# Altium schematic sheet CAMERA.SchDoc
size A2; SheetNumber: 20; SheetTotal: 22
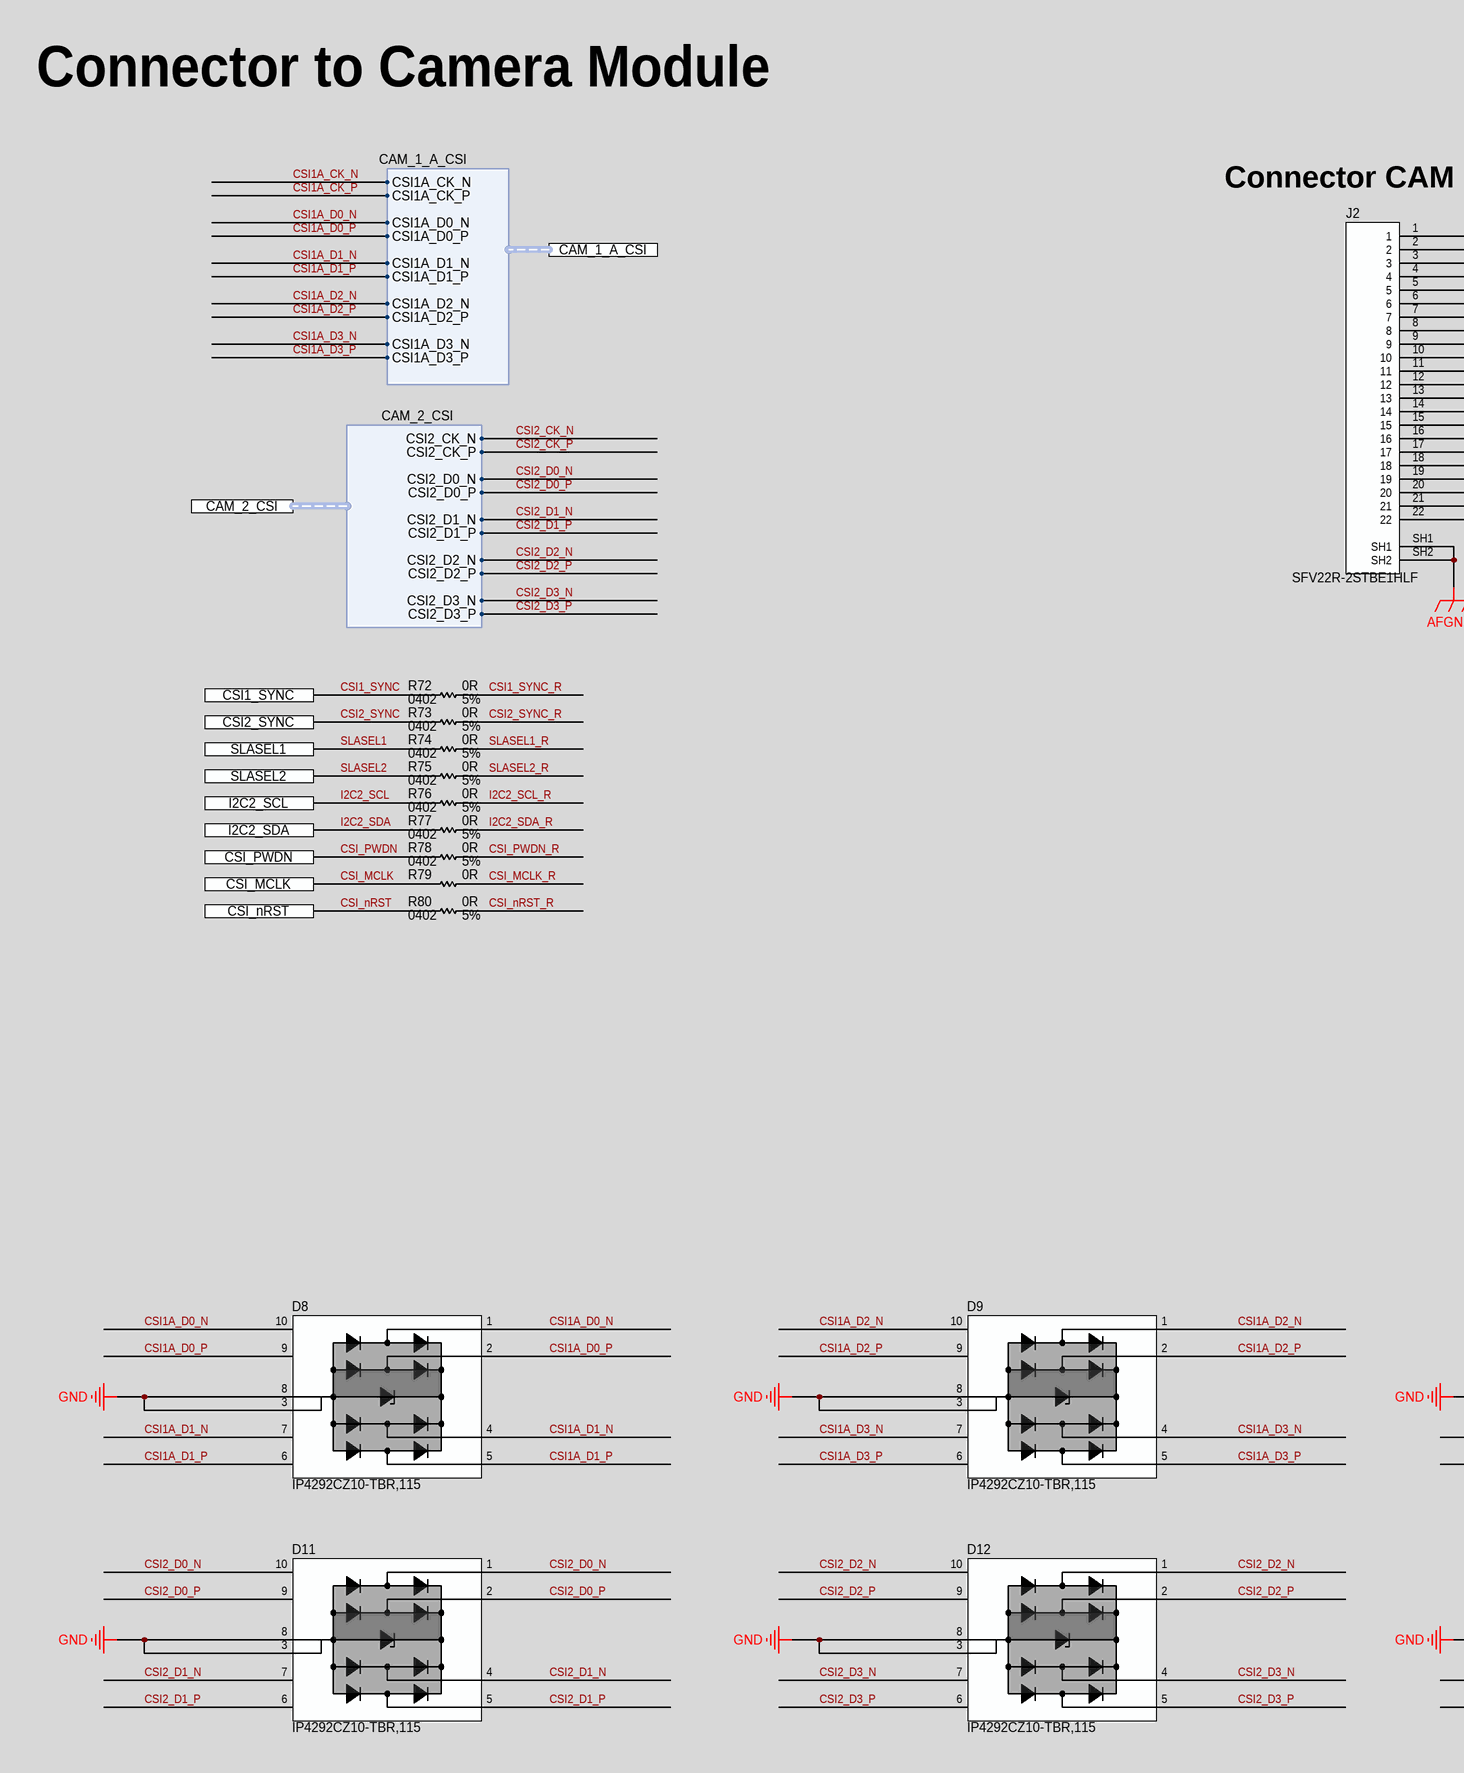
[diagram p0: CAMERA.SchDoc, left]
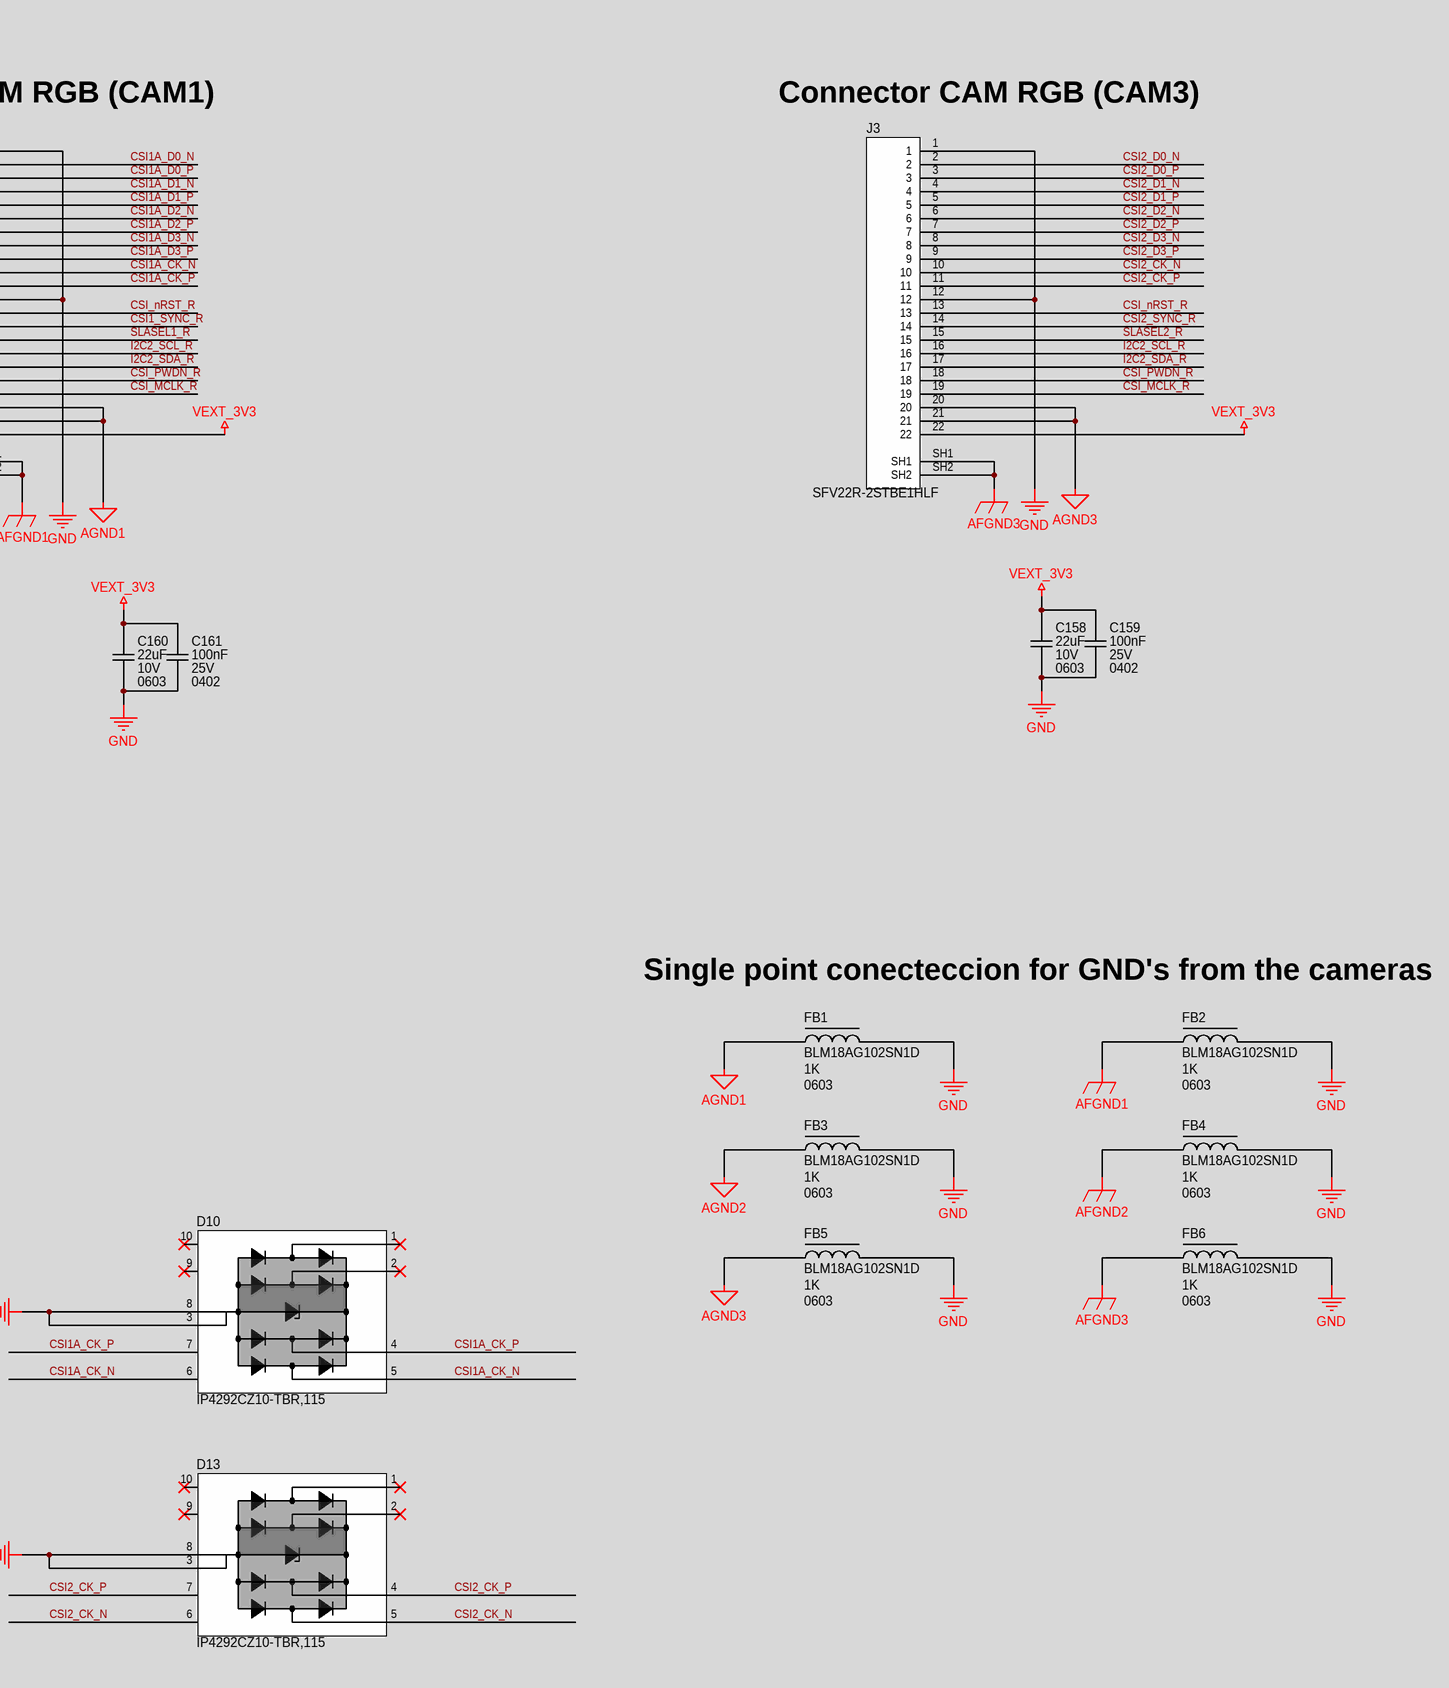
[diagram p1: CAMERA.SchDoc, right]

## Parts
C158  Capacitance: 22uF  Voltage Rating: 10V  Case Code (Imperial): 0603  [CAP_0603_CAPC1608X08N]  (hidden comment: C1608X5R1A226M080AC)
C159  Capacitance: 100nF  Voltage Rating: 25V  Case/Package: 0402  [CAP_0402_CAPC1005X05N]  (hidden comment: CC0402KRX5R8BB104)
C160  Capacitance: 22uF  Voltage Rating: 10V  Case Code (Imperial): 0603  [CAP_0603_CAPC1608X08N]  (hidden comment: C1608X5R1A226M080AC)
C161  Capacitance: 100nF  Voltage Rating: 25V  Case/Package: 0402  [CAP_0402_CAPC1005X05N]  (hidden comment: CC0402KRX5R8BB104)
D8  IP4292CZ10-TBR,115  [DIO_TVS_SON50P100X250X50-10N]
D9  IP4292CZ10-TBR,115  [DIO_TVS_SON50P100X250X50-10N]
D10  IP4292CZ10-TBR,115  [DIO_TVS_SON50P100X250X50-10N]
D11  IP4292CZ10-TBR,115  [DIO_TVS_SON50P100X250X50-10N]
D12  IP4292CZ10-TBR,115  [DIO_TVS_SON50P100X250X50-10N]
D13  IP4292CZ10-TBR,115  [DIO_TVS_SON50P100X250X50-10N]
FB1  BLM18AG102SN1D  Impedance: 1K  Case/Package: 0603  [IND_0603_INDC1608X08N]
FB2  BLM18AG102SN1D  Impedance: 1K  Case/Package: 0603  [IND_0603_INDC1608X08N]
FB3  BLM18AG102SN1D  Impedance: 1K  Case/Package: 0603  [IND_0603_INDC1608X08N]
FB4  BLM18AG102SN1D  Impedance: 1K  Case/Package: 0603  [IND_0603_INDC1608X08N]
FB5  BLM18AG102SN1D  Impedance: 1K  Case/Package: 0603  [IND_0603_INDC1608X08N]
FB6  BLM18AG102SN1D  Impedance: 1K  Case/Package: 0603  [IND_0603_INDC1608X08N]
J2  SFV22R-2STBE1HLF  [CONN_FPC_AMPHENOL_SFV22R-2STBE1HLF]
J3  SFV22R-2STBE1HLF  [CONN_FPC_AMPHENOL_SFV22R-2STBE1HLF]
R72  Case Code (Imperial): 0402  Tolerance: 5%  Resistance: 0R  [RES_0402_RESC1005X04N]  (hidden comment: ERJ-2GE0R00X)
R73  Case Code (Imperial): 0402  Tolerance: 5%  Resistance: 0R  [RES_0402_RESC1005X04N]  (hidden comment: ERJ-2GE0R00X)
R74  Case Code (Imperial): 0402  Tolerance: 5%  Resistance: 0R  [RES_0402_RESC1005X04N]  (hidden comment: ERJ-2GE0R00X)
R75  Case Code (Imperial): 0402  Tolerance: 5%  Resistance: 0R  [RES_0402_RESC1005X04N]  (hidden comment: ERJ-2GE0R00X)
R76  Case Code (Imperial): 0402  Tolerance: 5%  Resistance: 0R  [RES_0402_RESC1005X04N]  (hidden comment: ERJ-2GE0R00X)
R77  Case Code (Imperial): 0402  Tolerance: 5%  Resistance: 0R  [RES_0402_RESC1005X04N]  (hidden comment: ERJ-2GE0R00X)
R78  Case Code (Imperial): 0402  Tolerance: 5%  Resistance: 0R  [RES_0402_RESC1005X04N]  (hidden comment: ERJ-2GE0R00X)
R79  Resistance: 0R  [RES_0402_RESC1005X04N]  (hidden comment: ERJ-2GE0R00X)
R80  Case Code (Imperial): 0402  Tolerance: 5%  Resistance: 0R  [RES_0402_RESC1005X04N]  (hidden comment: ERJ-2GE0R00X)

## Ports
CAM_1_A_CSI (harness CAM_1_A_CSI), CAM_2_CSI (harness CAM_2_CSI), CSI1_SYNC, CSI2_SYNC, CSI_MCLK, CSI_nRST, CSI_PWDN, I2C2_SCL, I2C2_SDA, SLASEL1, SLASEL2

## Harnesses
CAM_2_CSI: CSI2_CK_N, CSI2_CK_P, CSI2_D0_N, CSI2_D0_P, CSI2_D1_N, CSI2_D1_P, CSI2_D2_N, CSI2_D2_P, CSI2_D3_N, CSI2_D3_P
CAM_1_A_CSI: CSI1A_CK_N, CSI1A_CK_P, CSI1A_D0_N, CSI1A_D0_P, CSI1A_D1_N, CSI1A_D1_P, CSI1A_D2_N, CSI1A_D2_P, CSI1A_D3_N, CSI1A_D3_P

## Nets
AFGND1: FB2.1 J2.SH1 J2.SH2
AFGND2: FB4.1
AFGND3: FB6.1 J3.SH1 J3.SH2
AGND1: FB1.1 J2.20 J2.21
AGND2: FB3.1
AGND3: FB5.1 J3.20 J3.21
GND: C158.1 C159.1 C160.1 C161.1 D8.3(GND1) D8.8(GND2) D9.3(GND1) D9.8(GND2) D10.3(GND1) D10.8(GND2) D11.3(GND1) D11.8(GND2) D12.3(GND1) D12.8(GND2) D13.3(GND1) D13.8(GND2) FB1.2 FB2.2 FB3.2 FB4.2 FB5.2 FB6.2 J2.1 J2.12 J3.1 J3.12
VEXT_3V3: C158.2 C159.2 C160.2 C161.2 J2.22 J3.22
CSI1_SYNC: R72.1 ; port CSI1_SYNC
CSI1_SYNC_R: J2.14 R72.2
CSI1A_CK_N: D10.5(CH4) D10.6(NC1) J2.10 ; port CAM_1_A_CSI.CSI1A_CK_N
CSI1A_CK_P: D10.4(CH3) D10.7(NC2) J2.11 ; port CAM_1_A_CSI.CSI1A_CK_P
CSI1A_D0_N: D8.1(CH1) D8.10(NC4) J2.2 ; port CAM_1_A_CSI.CSI1A_D0_N
CSI1A_D0_P: D8.2(CH2) D8.9(NC3) J2.3 ; port CAM_1_A_CSI.CSI1A_D0_P
CSI1A_D1_N: D8.4(CH3) D8.7(NC2) J2.4 ; port CAM_1_A_CSI.CSI1A_D1_N
CSI1A_D1_P: D8.5(CH4) D8.6(NC1) J2.5 ; port CAM_1_A_CSI.CSI1A_D1_P
CSI1A_D2_N: D9.1(CH1) D9.10(NC4) J2.6 ; port CAM_1_A_CSI.CSI1A_D2_N
CSI1A_D2_P: D9.2(CH2) D9.9(NC3) J2.7 ; port CAM_1_A_CSI.CSI1A_D2_P
CSI1A_D3_N: D9.4(CH3) D9.7(NC2) J2.8 ; port CAM_1_A_CSI.CSI1A_D3_N
CSI1A_D3_P: D9.5(CH4) D9.6(NC1) J2.9 ; port CAM_1_A_CSI.CSI1A_D3_P
CSI2_CK_N: D13.5(CH4) D13.6(NC1) J3.10 ; port CAM_2_CSI.CSI2_CK_N
CSI2_CK_P: D13.4(CH3) D13.7(NC2) J3.11 ; port CAM_2_CSI.CSI2_CK_P
CSI2_D0_N: D11.1(CH1) D11.10(NC4) J3.2 ; port CAM_2_CSI.CSI2_D0_N
CSI2_D0_P: D11.2(CH2) D11.9(NC3) J3.3 ; port CAM_2_CSI.CSI2_D0_P
CSI2_D1_N: D11.4(CH3) D11.7(NC2) J3.4 ; port CAM_2_CSI.CSI2_D1_N
CSI2_D1_P: D11.5(CH4) D11.6(NC1) J3.5 ; port CAM_2_CSI.CSI2_D1_P
CSI2_D2_N: D12.1(CH1) D12.10(NC4) J3.6 ; port CAM_2_CSI.CSI2_D2_N
CSI2_D2_P: D12.2(CH2) D12.9(NC3) J3.7 ; port CAM_2_CSI.CSI2_D2_P
CSI2_D3_N: D12.4(CH3) D12.7(NC2) J3.8 ; port CAM_2_CSI.CSI2_D3_N
CSI2_D3_P: D12.5(CH4) D12.6(NC1) J3.9 ; port CAM_2_CSI.CSI2_D3_P
CSI2_SYNC: R73.1 ; port CSI2_SYNC
CSI2_SYNC_R: J3.14 R73.2
CSI_MCLK: R79.1 ; port CSI_MCLK
CSI_MCLK_R: J2.19 J3.19 R79.2
CSI_nRST: R80.1 ; port CSI_nRST
CSI_nRST_R: J2.13 J3.13 R80.2
CSI_PWDN: R78.1 ; port CSI_PWDN
CSI_PWDN_R: J2.18 J3.18 R78.2
I2C2_SCL: R76.1 ; port I2C2_SCL
I2C2_SCL_R: J2.16 J3.16 R76.2
I2C2_SDA: R77.1 ; port I2C2_SDA
I2C2_SDA_R: J2.17 J3.17 R77.2
SLASEL1: R74.1 ; port SLASEL1
SLASEL1_R: J2.15 R74.2
SLASEL2: R75.1 ; port SLASEL2
SLASEL2_R: J3.15 R75.2

Not connected (* = marked no-connect by the designer): D10 1(CH1)* 2(CH2)* 9(NC3)* 10(NC4)*; D13 1(CH1)* 2(CH2)* 9(NC3)* 10(NC4)*

## Notes on the sheet
- Connector to Camera Module
- (near J2) Connector CAM RGB (CAM1)
- (near J3) Connector CAM RGB (CAM3)
- Single point conecteccion for GND's from the cameras
- PCB Des :
- Approv By :
- Project Title :
- Sheet Title :
- Date :
- Page :
- PCB Version :
- PCB Revision :
- Size :
- A2

## Library data of the parts
C158 C160 = CAP_22UF_10V_X5R_0603: Multilayer Ceramic Capacitor, 22 uF, 10 V, ± 20%, X5R, 0603 [1608 Metric]; Manufacturer: TDK; Supplier 1: Digi-Key; Manufacturer Part Number: C1608X5R1A226M080AC; RoHS: Yes; Category: Ceramic Capacitors; Stock 1: 1971709; Pricing 1: 1=0.32, 10=0.208, 50=0.1534, 100=0.1248, 500=0.09856, 1000=0.08323 (USD); Mount: Surface Mount; Case/Package: 0603; Case Code (Metric): 1608; Dielectric Material: Ceramic; Weight: 7.1E-05oz; Min Operating Temperature: -55°C; Max Operating Temperature: 85°C; Tolerance: 20%; Packaging: Tape and Reel; Voltage Rating (DC): 10V; Termination: SMD/SMT; Series: C; Package Quantity: 4000; Dielectric: X5R; Length: 1.6mm; Width: 0.8mm; Height: 0.8mm; Reach SVHC Compliant: No; Lead Free: Lead Free; RoHS Compliant: Yes; ComponentLink1URL: https://datasheet.ciiva.com/6274/tdkmlcccaprange-6274860.pdf?src-supplier=Digi-Key; ComponentLink1Description: https://datasheet.ciiva.com/6274/tdkmlcccaprange-6274860.pdf?src-supplier=Digi-Key; ComponentLink2URL: https://datasheet.ciiva.com/6274/tdkmlcccaprange-6274859.pdf?src-supplier=Digi-Key; ComponentLink2Description: https://datasheet.ciiva.com/6274/tdkmlcccaprange-6274859.pdf?src-supplier=Digi-Key; ComponentLink3URL: https://datasheet.ciiva.com/6274/tdkmlcccaprange-6274861.pdf?src-supplier=Digi-Key; ComponentLink3Description: https://datasheet.ciiva.com/6274/tdkmlcccaprange-6274861.pdf?src-supplier=Digi-Key; ComponentLink4URL: https://datasheet.ciiva.com/24216/mlcc-commercial-general-en-24216575.pdf?src-supplier=Mouser; ComponentLink4Description: https://datasheet.ciiva.com/24216/mlcc-commercial-general-en-24216575.pdf?src-supplier=Mouser; Supplier Part Number 1: 445-9077-1-ND
C159 C161 = CAP_100NF_25V_X7R_0402: Multilayer Ceramic Capacitor, 0.1 uF, 25 V, ± 10%, X7R, 0402 [1005 Metric]; Manufacturer: Yageo; Material: 4241ConductorMaterial; Dielectric: X5R; Temperature Coefficient: 30ppm/°C; Supplier 1: Digikey; Manufacturer Part Number: CC0402KRX5R8BB104; RoHS: Yes; Category: Ceramic Capacitors; Stock 1: 3706055; Pricing 1: 1=0.1, 10=0.037, 50=0.021, 100=0.0162, 500=0.01224, 1000=0.00961, 2500=0.00874, 5000=0.00804 (USD); Mount: Surface Mount; Case Code (Metric): 1005; Case Code (Imperial): 0402; Min Operating Temperature: -55°C; Max Operating Temperature: 85°C; Tolerance: 10%; Packaging: Tape and Reel; Voltage Rating (DC): 25V; Series: CC; RoHS Compliant: Yes; Lead Free: 5697LeadFree; Halogen Free: 5694HalogenFree; ComponentLink1URL: http://www.mouser.com/ds/2/447/UPY-GPHC_X5R_4V-to-50V_25-1131599.pdf?src-supplier=Mouser; ComponentLink1Description: http://www.mouser.com/ds/2/447/UPY-GPHC_X5R_4V-to-50V_25-1131599.pdf?src-supplier=Mouser; ComponentLink2URL: https://datasheet.octopart.com/CC0402KRX5R8BB104-Yageo-datasheet-137700082.pdf?src-supplier=Future+Electronics; ComponentLink2Description: https://datasheet.octopart.com/CC0402KRX5R8BB104-Yageo-datasheet-137700082.pdf?src-supplier=Future+Electronics; ComponentLink3URL: http://www.yageo.com/documents/recent/UPY-GPHC_X5R_4V-to-50V_25.pdf?src-supplier=Digikey; ComponentLink3Description: http://www.yageo.com/documents/recent/UPY-GPHC_X5R_4V-to-50V_25.pdf?src-supplier=Digikey; ComponentLink4URL: https://datasheet.octopart.com/CC0402KRX5R8BB104-Yageo-datasheet-140260304.pdf?src-supplier=Newark; ComponentLink4Description: https://datasheet.octopart.com/CC0402KRX5R8BB104-Yageo-datasheet-140260304.pdf?src-supplier=Newark; ComponentLink5URL: https://datasheet.octopart.com/CC0402KRX5R8BB104-Yageo-datasheet-170350636.pdf?src-supplier=Future+Electronics; ComponentLink5Description: https://datasheet.octopart.com/CC0402KRX5R8BB104-Yageo-datasheet-170350636.pdf?src-supplier=Future+Electronics; ComponentLink6URL: http://www.yageo.com/documents/recent/UPY-GPHC_X5R_4V-to-50V-16.pdf?src-supplier=Future+Electronics; ComponentLink6Description: http://www.yageo.com/documents/recent/UPY-GPHC_X5R_4V-to-50V-16.pdf?src-supplier=Future+Electronics; Supplier Part Number 1: 311-1697-6-ND
D8-D13 = DIO_TVS_4CH_4V_IP4292CZ10-TBR,115: IP4292CZ10 Series 4 Channel 4 V 0.55 pF ESD Protected TVS Diode - DFN2510A-10; Manufacturer: Nexperia; Supplier 1: Digikey; Manufacturer Part Number: IP4292CZ10-TBR,115; RoHS: Yes; Category: ESD and Circuit Protection ICs; Stock 1: 24808; Pricing 1: 1=0.51, 10=0.398, 100=0.2386, 500=0.22096, 1000=0.15025, 2000=0.13833 (USD); RoHS Compliant: Yes; ComponentLink1URL: https://assets.nexperia.com/documents/data-sheet/IP4292CZ10-TBR.pdf?src-supplier=Digikey; ComponentLink1Description: https://assets.nexperia.com/documents/data-sheet/IP4292CZ10-TBR.pdf?src-supplier=Digikey; Supplier Part Number 1: 1727-1219-1-ND
FB1-FB6 = IND_FERRITA_1K_450mA_BLM18AG102SN1D: Ferrite Beads Multi-Layer 1KOhm 25% 100MHz 450mA 500mOhm DCR 0603 T/R; Manufacturer: Murata; Material: Steel,Ferrite; Max DC Current: 400mA; DC Resistance (DCR): 500mR; Number of Lines: 1; Shielding: Unshielded; DC Resistance-Max: 700mR; Supplier 1: Digikey; Manufacturer Part Number: BLM18AG102SN1D; RoHS: Yes; Category: Ferrite Beads and Chips; Stock 1: 632067; Pricing 1: 1=0.1, 10=0.074, 25=0.0676, 50=0.0608, 100=0.0445, 250=0.0324, 500=0.02968, 1000=0.02564 (USD); Number of Pins: 2; Core Material: Ferrite; Case Code (Metric): 1608; Case Code (Imperial): 0603; Min Operating Temperature: -55°C; Max Operating Temperature: 125°C; Tolerance: 25%; Package Quantity: 1; Resistance: 500mR; Packaging: Tape and Reel; Current Rating: 400mA; Max Current Rating: 400mA; Termination: SMD/SMT; Test Frequency: 100MHz; DC Current: 400mA; Frequency: 100MHz; Number of Circuits: 1; Series: BLM18A; RMS Current (Irms): 450mA; Series Resistance: 500mR; Length: 1.6mm; Width: 0.8mm; Height: 0.8mm; Depth: 0.8mm; Radiation Hardening: No; Reach SVHC Compliant: No; Military Standard: Not; Lead Free: Lead Free; RoHS Compliant: Yes; ComponentLink1URL: https://datasheet.ciiva.com/1012/l0110s0100blm18a-1012016.pdf?src-supplier=Digikey; ComponentLink1Description: https://datasheet.ciiva.com/1012/l0110s0100blm18a-1012016.pdf?src-supplier=Digikey; ComponentLink2URL: https://datasheet.ciiva.com/5709/1756147-5709056.pdf?src-supplier=Farnell; ComponentLink2Description: https://datasheet.ciiva.com/5709/1756147-5709056.pdf?src-supplier=Farnell; ComponentLink3URL: https://datasheet.ciiva.com/11795/0900766b80032ea2-11795437.pdf?src-supplier=Rs; ComponentLink3Description: https://datasheet.ciiva.com/11795/0900766b80032ea2-11795437.pdf?src-supplier=Rs; ComponentLink4URL: https://datasheet.ciiva.com/29347/442253-da-01-en-chip-drossel-0603-1000r-400ma-1-6x0-8mm-29347887.pdf?src-supplier=Conrad; ComponentLink4Description: https://datasheet.ciiva.com/29347/442253-da-01-en-chip-drossel-0603-1000r-400ma-1-6x0-8mm-29347887.pdf?src-supplier=Conrad; ComponentLink5URL: https://datasheet.ciiva.com/41449/001172220-da-01-en-drossel-0603-1000r-1-6x0-8mm-4000st-41449508.pdf?src-supplier=Conrad; ComponentLink5Description: https://datasheet.ciiva.com/41449/001172220-da-01-en-drossel-0603-1000r-1-6x0-8mm-4000st-41449508.pdf?src-supplier=Conrad; ComponentLink6URL: https://datasheet.ciiva.com/1012/l0110s0100blm18a-1012014.pdf?src-supplier=Digikey; ComponentLink6Description: https://datasheet.ciiva.com/1012/l0110s0100blm18a-1012014.pdf?src-supplier=Digikey; ComponentLink7URL: https://datasheet.ciiva.com/1012/l0110s0100blm18a-1012015.pdf?src-supplier=Digikey; ComponentLink7Description: https://datasheet.ciiva.com/1012/l0110s0100blm18a-1012015.pdf?src-supplier=Digikey; ComponentLink8URL: https://datasheet.ciiva.com/16199/l0110s0100blm18a-16199225.pdf?src-supplier=Future+Electronics; ComponentLink8Description: https://datasheet.ciiva.com/16199/l0110s0100blm18a-16199225.pdf?src-supplier=Future+Electronics; ComponentLink9URL: https://datasheet.ciiva.com/8510/l0110s0100blm18a-8510154.pdf?src-supplier=Avnet; ComponentLink9Description: https://datasheet.ciiva.com/8510/l0110s0100blm18a-8510154.pdf?src-supplier=Avnet; ComponentLink10URL: https://datasheet.ciiva.com/1466/1756147-1466919.pdf?src-supplier=Element14; ComponentLink10Description: https://datasheet.ciiva.com/1466/1756147-1466919.pdf?src-supplier=Element14; ComponentLink11URL: https://datasheet.ciiva.com/1466/1756147-1466920.pdf?src-supplier=Element14; ComponentLink11Description: https://datasheet.ciiva.com/1466/1756147-1466920.pdf?src-supplier=Element14; Supplier Part Number 1: 490-1015-1-ND
J2 J3 = CONN_FPC_22P_0.5mm_SFV22R-2STBE1HLF: Conn FFC/FPC Connector SKT 22 POS 0.5mm Solder RA SMD Embossed T/R; Manufacturer: Amphenol ICC / FCI; Actuator Material: Glass,Polyphenylene; Voltage Rating: 50V; Current Rating: 500mA; Number of Positions: 22; Contact Location: Top; Insulation Resistance: 100MR; Wire/Cable Type: Straight; Supplier 1: Digikey; Manufacturer Part Number: SFV22R-2STBE1HLF; RoHS: Yes; Category: FFC / FPC; Stock 1: 4153; Pricing 1: 1=0.74, 10=0.627, 25=0.6016, 50=0.5888, 100=0.5633, 250=0.51208, 500=0.46086, 1000=0.40966 (USD); Mount: Surface Mount; Contact Material: Bronze; Contact Plating: Gold; Housing Material: Polymer; Min Operating Temperature: -55°C; Max Operating Temperature: 105°C; Termination: Solder; Number of Contacts: 22; Orientation: Right Angle; Packaging: Tape and Reel; Package Quantity: 3000; Series: SFV-R; Pitch: 0.5mm; Radiation Hardening: No; Flammability Rating: UL94 V-0; RoHS Compliant: Yes; ComponentLink1URL: https://datasheet.ciiva.com/18563/sfv12b-hlf-18563830.pdf?src-supplier=Digikey; ComponentLink1Description: https://datasheet.ciiva.com/18563/sfv12b-hlf-18563830.pdf?src-supplier=Digikey; Supplier Part Number 1: 609-SFV22R-2STBE1HLFCT-ND
R72-R80 = RES_0R_5%_100mW_0402: SMD Chip Resistor, Jumper, 0 ohm, 100 mW, 0402 [1005 Metric], Thick Film, General Purpose; Manufacturer: Panasonic; Power Rating: 100mW; Voltage Rating: 50V; Temperature Coefficient: 600ppm/°C; Supplier 1: Mouser; Manufacturer Part Number: ERJ-2GE0R00X; RoHS: Yes; Category: Chip SMD Resistors; Stock 1: 10989354; Pricing 1: 1=0.1, 10=0.013, 50=0.013, 100=0.006, 1000=0.004, 2500=0.003, 10000=0.003 (USD); Mount: Surface Mount; Case/Package: 0402; Contact Plating: Tin; Case Code (Metric): 1005; Size Code: 0402; Min Operating Temperature: -55°C; Max Operating Temperature: 155°C; Resistor Type: Thick Film; Packaging: Cut Tape; Package Quantity: 10000; Number of Terminations: 2; Termination: SMD/SMT; Max Power Dissipation: 100mW; Voltage Rating (DC): 50V; Features: Automotive AEC-Q200; Series: ERJ; Construction: Rectangular; Technology: THICK FILM; Length: 1mm; Width: 0.5mm; Height: 0.35mm; Depth: 0.5mm; Ratings: AEC-Q200; Radiation Hardening: No; Reach SVHC Compliant: No; Military Standard: Not; Lead Free: Lead Free; RoHS Compliant: Yes; ComponentLink1URL: https://datasheet.ciiva.com/11821/0900766b80f806dd-11821176.pdf?src-supplier=Rs; ComponentLink1Description: https://datasheet.ciiva.com/11821/0900766b80f806dd-11821176.pdf?src-supplier=Rs; ComponentLink2URL: https://datasheet.ciiva.com/43460/1678796-43460347.pdf?src-supplier=Farnell; ComponentLink2Description: https://datasheet.ciiva.com/43460/1678796-43460347.pdf?src-supplier=Farnell; ComponentLink3URL: https://datasheet.ciiva.com/46389/1678796-46389518.pdf?src-supplier=Element14; ComponentLink3Description: https://datasheet.ciiva.com/46389/1678796-46389518.pdf?src-supplier=Element14; ComponentLink4URL: https://datasheet.ciiva.com/5959/1678796-5959692.pdf?src-supplier=Farnell; ComponentLink4Description: https://datasheet.ciiva.com/5959/1678796-5959692.pdf?src-supplier=Farnell; ComponentLink5URL: https://datasheet.ciiva.com/28695/1678796-28695758.pdf?src-supplier=Element14; ComponentLink5Description: https://datasheet.ciiva.com/28695/1678796-28695758.pdf?src-supplier=Element14; ComponentLink6URL: https://datasheet.ciiva.com/16783/70260739-16783734.pdf?src-supplier=Allied+Electronics; ComponentLink6Description: https://datasheet.ciiva.com/16783/70260739-16783734.pdf?src-supplier=Allied+Electronics; ComponentLink7URL: https://datasheet.ciiva.com/16778/70260739-16778335.pdf?src-supplier=Allied+Electronics; ComponentLink7Description: https://datasheet.ciiva.com/16778/70260739-16778335.pdf?src-supplier=Allied+Electronics; ComponentLink8URL: https://datasheet.ciiva.com/48531/aoa0000ce1-48531077.pdf?src-supplier=Avnet; ComponentLink8Description: https://datasheet.ciiva.com/48531/aoa0000ce1-48531077.pdf?src-supplier=Avnet; ComponentLink9URL: https://datasheet.ciiva.com/30097/4aoa0000ce1-30097116.pdf?src-supplier=Onlinecomponents.com; ComponentLink9Description: https://datasheet.ciiva.com/30097/4aoa0000ce1-30097116.pdf?src-supplier=Onlinecomponents.com; Supplier Part Number 1: 667-ERJ-2GE0R00X